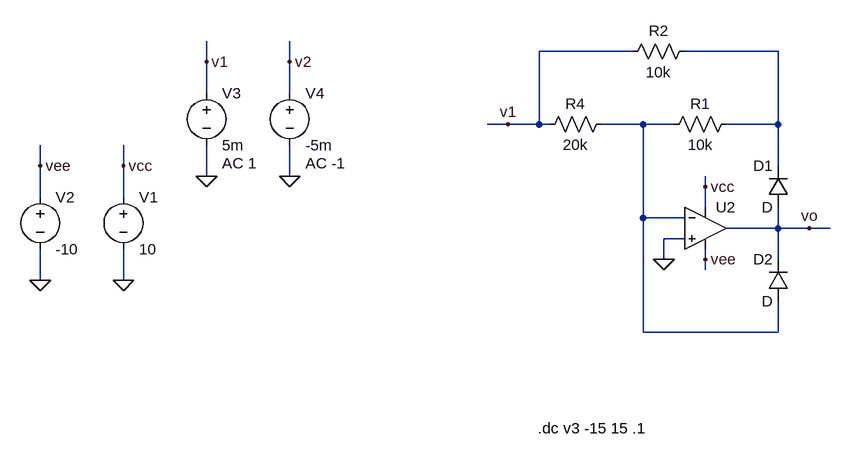
[diagram p0: schematic Draft2.asc]
Draft2.asc, the LTspice schematic file:
Version 4
SHEET 1 880 680
WIRE -32 -96 -176 -96
WIRE 192 -96 48 -96
WIRE -688 -80 -688 -112
WIRE -560 -80 -560 -112
WIRE -688 -32 -688 -80
WIRE -560 -32 -560 -80
WIRE -224 16 -256 16
WIRE -176 16 -176 -96
WIRE -176 16 -224 16
WIRE -160 16 -176 16
WIRE -16 16 -80 16
WIRE 32 16 -16 16
WIRE 192 16 192 -96
WIRE 192 16 112 16
WIRE -944 80 -944 48
WIRE -816 80 -816 48
WIRE 192 80 192 16
WIRE -688 96 -688 48
WIRE -560 96 -560 48
WIRE 80 112 80 96
WIRE -944 128 -944 80
WIRE -816 128 -816 80
WIRE 80 144 80 112
WIRE -16 160 -16 16
WIRE 48 160 -16 160
WIRE 192 176 192 144
WIRE 192 176 112 176
WIRE 240 176 192 176
WIRE 272 176 240 176
WIRE 48 192 16 192
WIRE 16 224 16 192
WIRE 80 224 80 208
WIRE 192 224 192 176
WIRE 80 240 80 224
WIRE -944 256 -944 208
WIRE -816 256 -816 208
WIRE -16 336 -16 160
WIRE 192 336 192 288
WIRE 192 336 -16 336
FLAG -816 256 0
FLAG -816 80 vcc
FLAG -944 256 0
FLAG -944 80 vee
FLAG -688 96 0
FLAG -688 -80 v1
FLAG -560 96 0
FLAG -560 -80 v2
FLAG 80 112 vcc
FLAG 80 224 vee
FLAG 16 224 0
FLAG 240 176 vo
FLAG -224 16 v1
SYMBOL voltage -816 112 R0
WINDOW 123 0 0 Left 0
WINDOW 39 0 0 Left 0
SYMATTR InstName V1
SYMATTR Value 10
SYMBOL voltage -944 112 R0
WINDOW 123 0 0 Left 0
WINDOW 39 0 0 Left 0
SYMATTR InstName V2
SYMATTR Value -10
SYMBOL voltage -688 -48 R0
WINDOW 123 24 124 Left 2
WINDOW 39 0 0 Left 0
SYMATTR InstName V3
SYMATTR Value 5m
SYMATTR Value2 AC 1
SYMBOL voltage -560 -48 R0
WINDOW 123 24 124 Left 2
WINDOW 39 0 0 Left 0
SYMATTR InstName V4
SYMATTR Value -5m
SYMATTR Value2 AC -1
SYMBOL OpAmps\\UniversalOpamp2 80 176 R0
SYMATTR InstName U2
SYMBOL res 64 -112 R90
WINDOW 0 0 56 VBottom 2
WINDOW 3 32 56 VTop 2
SYMATTR InstName R2
SYMATTR Value 10k
SYMBOL diode 208 144 R180
WINDOW 0 24 64 Left 2
WINDOW 3 24 0 Left 2
SYMATTR InstName D1
SYMBOL res -64 0 R90
WINDOW 0 0 56 VBottom 2
WINDOW 3 32 56 VTop 2
SYMATTR InstName R4
SYMATTR Value 20k
SYMBOL res 128 0 R90
WINDOW 0 0 56 VBottom 2
WINDOW 3 32 56 VTop 2
SYMATTR InstName R1
SYMATTR Value 10k
SYMBOL diode 208 288 R180
WINDOW 0 24 64 Left 2
WINDOW 3 24 0 Left 2
SYMATTR InstName D2
TEXT -178 484 Left 2 !.dc v3 -15 15 .1

The netlist it stands for:
* Draft2.asc
V1 vcc 0 10
V2 vee 0 -10
V3 v1 0 5m AC 1
V4 v2 0 -5m AC -1
XU2 0 N002 vcc vee vo level.2 Avol=1Meg GBW=10Meg Slew=10Meg ilimit=25m rail=0 Vos=0 phimargin=45 en=0 enk=0 in=0 ink=0 Rin=500Meg  ; pins IN+ IN- V+ V- OUT
R2 N001 v1 10k
D1 vo N001 D
R4 N002 v1 20k
R1 N001 N002 10k
D2 N002 vo D
.model D D
.lib standard.dio
.dc v3 -15 15 .1
.lib UniversalOpamps2.sub
.backanno
.end